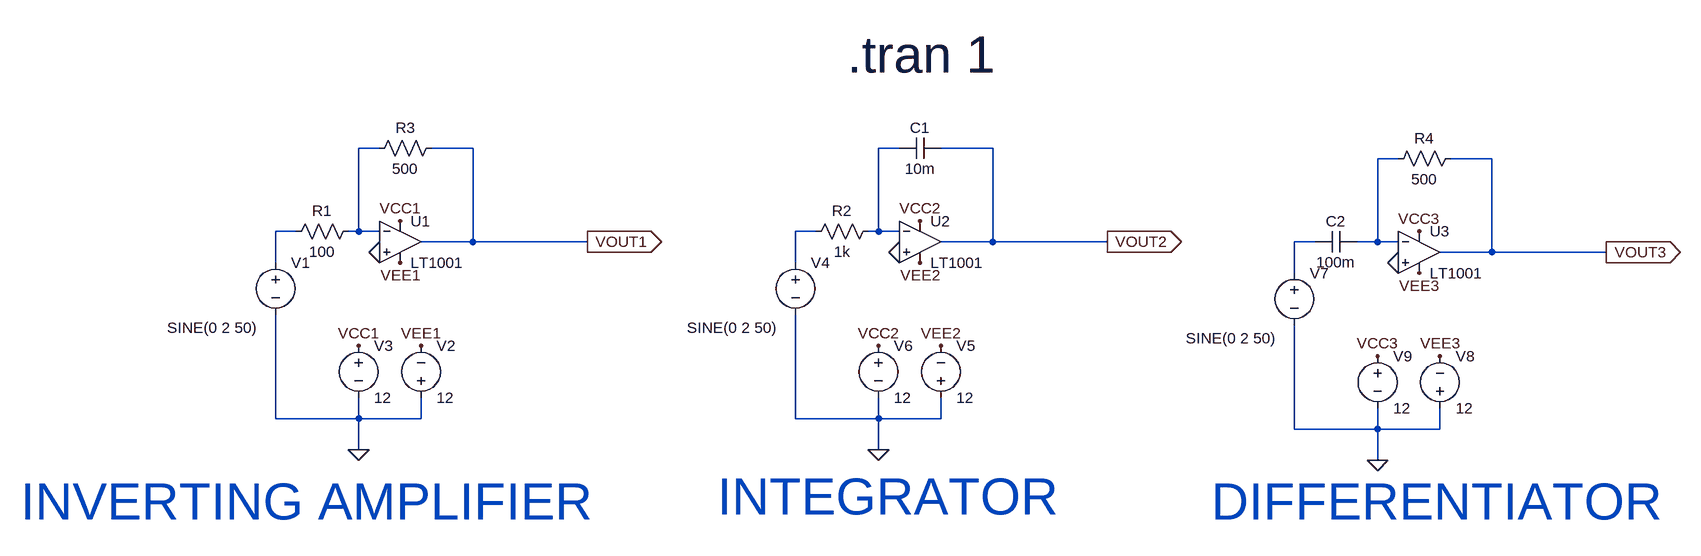
[diagram p0: schematic OP APMS.asc]
OP APMS.asc, the LTspice schematic file:
Version 4
SHEET 1 2220 680
WIRE 96 80 64 80
WIRE 240 80 176 80
WIRE 896 80 864 80
WIRE 1040 80 960 80
WIRE 1664 96 1632 96
WIRE 1808 96 1744 96
WIRE -32 208 -64 208
WIRE 64 208 64 80
WIRE 64 208 48 208
WIRE 96 208 64 208
WIRE 768 208 736 208
WIRE 864 208 864 80
WIRE 864 208 848 208
WIRE 896 208 864 208
WIRE 240 224 240 80
WIRE 240 224 160 224
WIRE 416 224 240 224
WIRE 1040 224 1040 80
WIRE 1040 224 960 224
WIRE 1216 224 1040 224
WIRE 1536 224 1504 224
WIRE 1632 224 1632 96
WIRE 1632 224 1600 224
WIRE 1664 224 1632 224
WIRE 1808 240 1808 96
WIRE 1808 240 1728 240
WIRE 1984 240 1808 240
WIRE -64 256 -64 208
WIRE 736 256 736 208
WIRE 1504 272 1504 224
WIRE -64 496 -64 336
WIRE 64 496 64 464
WIRE 64 496 -64 496
WIRE 160 496 160 464
WIRE 160 496 64 496
WIRE 736 496 736 336
WIRE 864 496 864 464
WIRE 864 496 736 496
WIRE 960 496 960 464
WIRE 960 496 864 496
WIRE 1504 512 1504 352
WIRE 1632 512 1632 480
WIRE 1632 512 1504 512
WIRE 1728 512 1728 480
WIRE 1728 512 1632 512
WIRE 64 544 64 496
WIRE 864 544 864 496
WIRE 1632 560 1632 512
FLAG 64 544 0
FLAG 64 384 VCC1
FLAG 160 384 VEE1
FLAG 128 256 VEE1
FLAG 128 192 VCC1
FLAG 416 224 VOUT1
IOPIN 416 224 Out
FLAG 96 240 0
FLAG 864 544 0
FLAG 864 384 VCC2
FLAG 960 384 VEE2
FLAG 928 256 VEE2
FLAG 928 192 VCC2
FLAG 1216 224 VOUT2
IOPIN 1216 224 Out
FLAG 896 240 0
FLAG 1632 560 0
FLAG 1632 400 VCC3
FLAG 1728 400 VEE3
FLAG 1696 272 VEE3
FLAG 1696 208 VCC3
FLAG 1984 240 VOUT3
IOPIN 1984 240 Out
FLAG 1664 256 0
SYMBOL voltage -64 240 R0
WINDOW 3 -167 116 Left 2
WINDOW 123 0 0 Left 0
WINDOW 39 0 0 Left 0
SYMATTR Value SINE(0 2 50)
SYMATTR InstName V1
SYMBOL res -48 224 R270
WINDOW 0 32 56 VTop 2
WINDOW 3 0 56 VBottom 2
SYMATTR InstName R1
SYMATTR Value 100
SYMBOL res 192 64 R90
WINDOW 0 0 56 VBottom 2
WINDOW 3 32 56 VTop 2
SYMATTR InstName R3
SYMATTR Value 500
SYMBOL OpAmps\\LT1001 128 160 R0
SYMATTR InstName U1
SYMBOL voltage 160 480 M180
WINDOW 0 24 96 Left 2
WINDOW 3 24 16 Left 2
WINDOW 123 0 0 Left 0
WINDOW 39 0 0 Left 0
SYMATTR InstName V2
SYMATTR Value 12
SYMBOL voltage 64 368 R0
WINDOW 123 0 0 Left 0
WINDOW 39 0 0 Left 0
SYMATTR InstName V3
SYMATTR Value 12
SYMBOL voltage 736 240 R0
WINDOW 3 -167 116 Left 2
WINDOW 123 0 0 Left 0
WINDOW 39 0 0 Left 0
SYMATTR Value SINE(0 2 50)
SYMATTR InstName V4
SYMBOL res 752 224 R270
WINDOW 0 32 56 VTop 2
WINDOW 3 0 56 VBottom 2
SYMATTR InstName R2
SYMATTR Value 1k
SYMBOL OpAmps\\LT1001 928 160 R0
SYMATTR InstName U2
SYMBOL voltage 960 480 M180
WINDOW 0 24 96 Left 2
WINDOW 3 24 16 Left 2
WINDOW 123 0 0 Left 0
WINDOW 39 0 0 Left 0
SYMATTR InstName V5
SYMATTR Value 12
SYMBOL voltage 864 368 R0
WINDOW 123 0 0 Left 0
WINDOW 39 0 0 Left 0
SYMATTR InstName V6
SYMATTR Value 12
SYMBOL cap 960 64 R90
WINDOW 0 0 32 VBottom 2
WINDOW 3 32 32 VTop 2
SYMATTR InstName C1
SYMATTR Value 10m
SYMBOL voltage 1504 256 R0
WINDOW 3 -167 116 Left 2
WINDOW 123 0 0 Left 0
WINDOW 39 0 0 Left 0
SYMATTR Value SINE(0 2 50)
SYMATTR InstName V7
SYMBOL res 1648 112 R270
WINDOW 0 32 56 VTop 2
WINDOW 3 0 56 VBottom 2
SYMATTR InstName R4
SYMATTR Value 500
SYMBOL OpAmps\\LT1001 1696 176 R0
SYMATTR InstName U3
SYMBOL voltage 1728 496 M180
WINDOW 0 24 96 Left 2
WINDOW 3 24 16 Left 2
WINDOW 123 0 0 Left 0
WINDOW 39 0 0 Left 0
SYMATTR InstName V8
SYMATTR Value 12
SYMBOL voltage 1632 384 R0
WINDOW 123 0 0 Left 0
WINDOW 39 0 0 Left 0
SYMATTR InstName V9
SYMATTR Value 12
SYMBOL cap 1600 208 R90
WINDOW 0 0 32 VBottom 2
WINDOW 3 32 32 VTop 2
SYMATTR InstName C2
SYMATTR Value 100m
TEXT 816 -64 Left 6 !.tran 1
TEXT -456 624 Left 6 ;INVERTING AMPLIFIER
TEXT 616 616 Left 6 ;INTEGRATOR
TEXT 1376 624 Left 6 ;DIFFERENTIATOR

The netlist it stands for:
* OP APMS.asc
V1 N004 0 SINE(0 2 50)
R1 N004 N001 100
R3 VOUT1 N001 500
XU1 0 N001 VCC1 VEE1 VOUT1 LT1001  ; pins In+ In- V+ V- OUT
V2 0 VEE1 12
V3 VCC1 0 12
V4 N005 0 SINE(0 2 50)
R2 N005 N002 1k
XU2 0 N002 VCC2 VEE2 VOUT2 LT1001  ; pins In+ In- V+ V- OUT
V5 0 VEE2 12
V6 VCC2 0 12
C1 VOUT2 N002 10m
V7 N006 0 SINE(0 2 50)
R4 N003 VOUT3 500
XU3 0 N003 VCC3 VEE3 VOUT3 LT1001  ; pins In+ In- V+ V- OUT
V8 0 VEE3 12
V9 VCC3 0 12
C2 N003 N006 100m
.tran 1
* INVERTING AMPLIFIER
* INTEGRATOR
* DIFFERENTIATOR
.lib LTC.lib
.backanno
.end